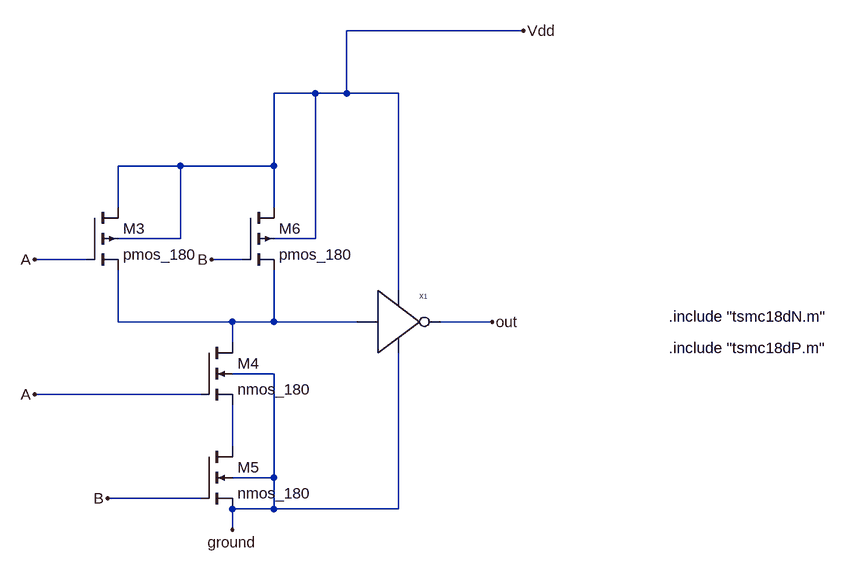
[diagram p0: schematic CMOS_AND.asc]
CMOS_AND.asc, the LTspice schematic file:
Version 4.1
SHEET 1 2172 1200
WIRE 1168 192 896 192
WIRE 848 288 784 288
WIRE 896 288 896 192
WIRE 896 288 848 288
WIRE 976 288 896 288
WIRE 640 400 544 400
WIRE 784 400 784 288
WIRE 784 400 640 400
WIRE 544 464 544 400
WIRE 784 464 784 400
WIRE 640 512 640 400
WIRE 640 512 544 512
WIRE 848 512 848 288
WIRE 848 512 784 512
WIRE 496 544 416 544
WIRE 736 544 688 544
WIRE 976 592 976 288
WIRE 544 640 544 560
WIRE 720 640 544 640
WIRE 784 640 784 560
WIRE 784 640 720 640
WIRE 912 640 784 640
WIRE 1120 640 1040 640
WIRE 720 672 720 640
WIRE 784 720 720 720
WIRE 672 752 416 752
WIRE 720 832 720 768
WIRE 784 880 784 720
WIRE 784 880 720 880
WIRE 672 912 528 912
WIRE 784 928 784 880
WIRE 784 928 720 928
WIRE 976 928 976 688
WIRE 976 928 784 928
WIRE 720 960 720 928
FLAG 416 544 A
FLAG 416 752 A
FLAG 528 912 B
FLAG 688 544 B
FLAG 1168 192 Vdd
FLAG 720 960 ground
FLAG 1120 640 out
SYMBOL pmos4 496 464 R0
SYMATTR InstName M3
SYMATTR Value pmos_180
SYMATTR Value2 l=180n w=1u
SYMBOL nmos4 672 672 R0
SYMATTR InstName M4
SYMATTR Value nmos_180
SYMATTR Value2 l=180n w=1u
SYMBOL nmos4 672 832 R0
SYMATTR InstName M5
SYMATTR Value nmos_180
SYMATTR Value2 l=180n w=1u
SYMBOL pmos4 736 464 R0
SYMATTR InstName M6
SYMATTR Value pmos_180
SYMATTR Value2 l=180n w=1u
SYMBOL CMOS_NOT 960 640 R0
SYMATTR InstName X1
TEXT 1392 632 Left 2 !.include "tsmc18dN.m"
TEXT 1392 680 Left 2 !.include "tsmc18dP.m"

The netlist it stands for:
* CMOS_AND.asc
M3 Vdd A N001 Vdd pmos_180 l=180n w=1u
M4 N001 A N002 ground nmos_180 l=180n w=1u
M5 N002 B ground ground nmos_180 l=180n w=1u
M6 Vdd B N001 Vdd pmos_180 l=180n w=1u
X§X1 Vdd ground N001 out CMOS_NOT  ; pins Vdd ground in out
.model NMOS NMOS
.model PMOS PMOS
.lib standard.mos
.include "tsmc18dN.m"
.include "tsmc18dP.m"
.backanno
.end